# EAGLE schematic Template Komponen (EAGLE 7.6.0)
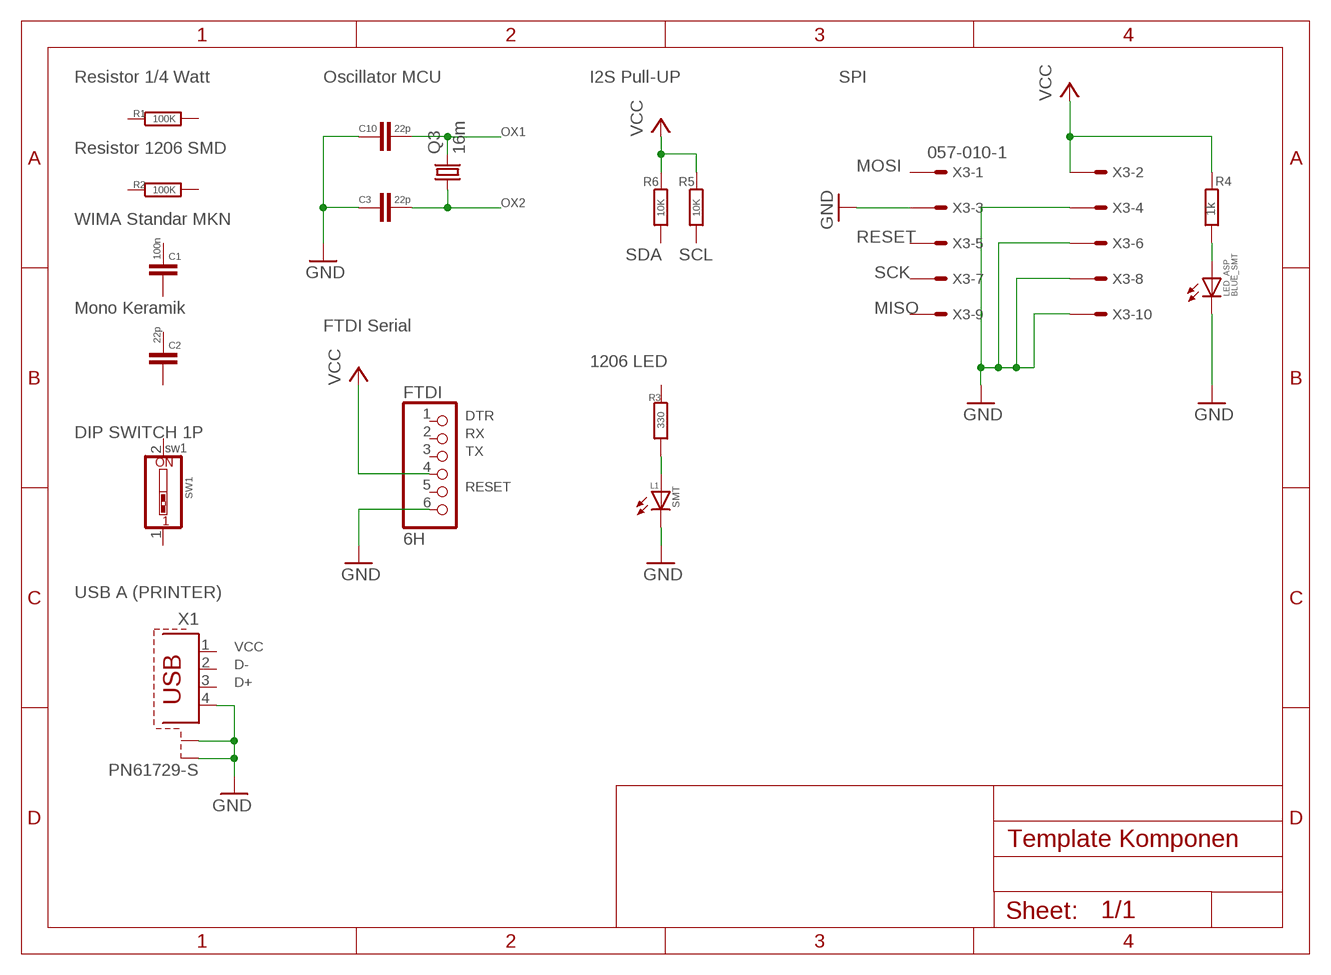
[diagram p0: schematic, sheet 1]

## Parts
C1  100n  C-EU050-025X075  [C050-025X075]
C2  22p  C-EU050-024X044  [C050-024X044]
C3  22p  C-EUC1206  [C1206]
C10  22p  C-EUC1206  [C1206]
FTDI  6H  PINHD-1X6  [1X06]
L1  SMT  LEDSMT1206  [1206]
LED_ASP  BLUE_SMT  LEDSMT1206  [1206]
Q3  16m  CRYSTALHC49UP  [HC49UP]
R1  100K  R-EU_0204/7  [0204/7]
R2  100K  R-EU_R1206  [R1206]
R3  330  R-EU_R1206  [R1206]
R4  1k  R-EU_R1206  [R1206]
R5  10K  R-EU_0204/7  [0204/7]
R6  10K  R-EU_0204/7  [0204/7]
SW1  sw1  SW_DIP-1  [EDG-01]
X1  PN61729-S  [PN61729-S]
X3  057-010-1  [057-010-1]

## Nets
GND: C3.1 C10.1 FTDI.6 L1.C LED_ASP.C X1.4 X1.S1 X1.S2 X3.3 X3.4 X3.6 X3.8 X3.10
N$2: L1.A R3.2
N$3: LED_ASP.A R4.2
OX1: C10.2 Q3.2
OX2: C3.2 Q3.1
VCC: FTDI.4 R4.1 R5.1 R6.1 X3.2
Unconnected: C1.1 C1.2 C2.1 C2.2 FTDI.1 FTDI.2 FTDI.3 FTDI.5 R1.1 R1.2 R2.1 R2.2 R3.1 R5.2 R6.2 SW1.1 SW1.2 X1.1 X1.2 X1.3 X3.1 X3.5 X3.7 X3.9

## Notes on the sheet
- Resistor 1/4 Watt | Oscillator MCU | I2S Pull-UP | SPI
- Resistor 1206 SMD
- MOSI
- WIMA Standar MKN
- RESET
- SDA | SCL
- SCK
- Mono Keramik | MISO
- FTDI Serial
- 1206 LED
- DTR
- DIP SWITCH 1P | RX
- TX
- RESET
- USB A (PRINTER)
- VCC
- D-
- D+

## Library data of the parts
C1-C3 C10 = resistor:C-EU: CAPACITOR, European symbol
FTDI = adafruit:PINHD-1X6: PIN HEADER
L1 LED_ASP = adafruit:LED: LED OSRAM: - CHIPLED LG R971, LG N971, LY N971, LG Q971, LY Q971, LO R971, LY R971 LH N974, LH R974 LS Q976, LO Q976, LY Q976 LO Q996 - Hyper CHIPLED LW Q18S LB Q993, LB Q99A, LB R99A - SideLED LS A670, LO A670, LY A670, LG A670, LP A670 LB A673, LV A673, LT A673, LW A673 LH A674 LY A675 LS A676, LA A676, LO A676, LY A676, LW A676 LS A679, LY A679, LG A679 - Hyper Micro SIDELED® LS Y876, LA Y876, LO Y876, LY Y876 LT Y87S - SmartLED LW L88C, LW L88S LB L89C, LB L89S, LG L890 LS L89K, LO L89K, LY L89K LS L896, LA L896, LO L896, LY L896 - TOPLED LS T670, LO T670, LY T670, LG T670, LP T670 LSG T670, LSP T670, LSY T670, LOP T670, LYG T670 LG T671, LOG T671, LSG T671 LB T673, LV T673, LT T673, LW T673 LH T674 LS T676, LA T676, LO T676, LY T676, LB T676, LH T676, LSB T676, LW T676 LB T67C, LV T67C, LT T67C, LS T67K, LO T67K, LY T67K, LW E67C LS E67B, LA E67B, LO E67B, LY E67B, LB E67C, LV E67C, LT E67C LW T67C LS T679, LY T679, LG T679 LS T770, LO T770, LY T770, LG T770, LP T770 LB T773, LV T773, LT T773, LW T773 LH T774 LS E675, LA E675, LY E675, LS T675 LS T776, LA T776, LO T776, LY T776, LB T776 LHGB T686 LT T68C, LB T68C - Hyper Mini TOPLED® LB M676 - Mini TOPLED Santana® LG M470 LS M47K, LO M47K, LY M47K Source: http://www.osram.convergy.de/
Q3 = adafruit:CRYSTAL: CRYSTAL; OC_FARNELL: unknown; OC_NEWARK: unknown
R1-R6 = resistor:R-EU_: RESISTOR, European symbol
SW1 = special:SW_DIP-1: DIP SWITCH
X1 = con-berg:PN61729-S: BERG USB connector; OC_FARNELL: unknown; OC_NEWARK: unknown
X3 = con-panduit:057-010-: CONNECTOR 10-pin series 057 contact pc board low profile headers; OC_FARNELL: unknown; OC_NEWARK: unknown